# Altium schematic sheet sch_camera2.SchDoc
size A4
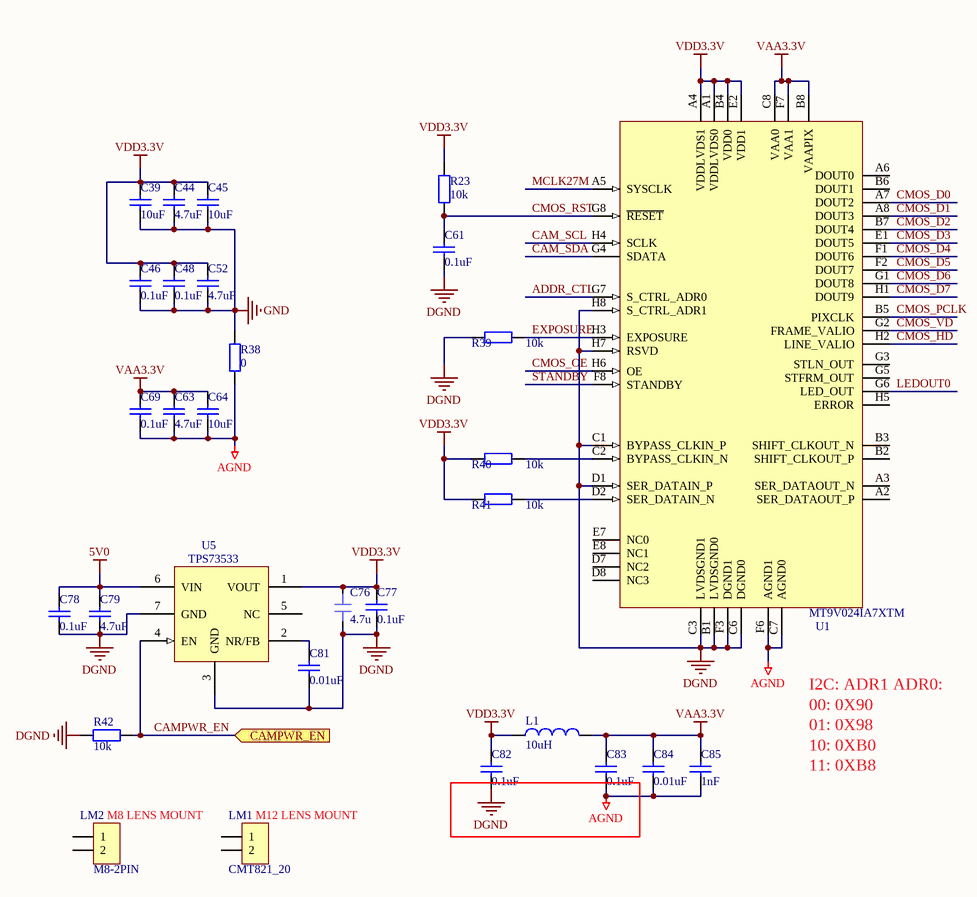
[diagram p0: sch_camera2.SchDoc]

## Parts
C39  10uF  [0805C]
C44  4.7uF  [0402C]
C45  10uF  [0805C]
C46  0.1uF  [0402C]
C48  0.1uF  [0402C]
C52  4.7uF  [0402C]
C61  0.1uF  [0402C]
C63  4.7uF  [0402C]
C64  10uF  [0805C]
C69  0.1uF  [0402C]
C76  4.7u  [0402C_L]
C77  0.1uF  [0402C_L]
C78  0.1uF  [0402C]
C79  4.7uF  [0402C_L]
C81  0.01uF  [0402C_L]
C82  0.1uF  [0402C_L]
C83  0.1uF  [0402C_L]
C84  0.01uF  [0402C_L]
C85  1nF  [0402C_L]
L1  10uH  [0805R]
LM1  CMT821_20  [PAD_M3_D350_450]
LM2  M8-2PIN  [PAD_M3_D350_450]
R23  10K  [0402R]
R38  value 0  [0402R]  (hidden comment: 0R)
R39  10K  [0402R]
R40  10K  [0402R]
R41  10K  [0402R]
R42  10K  [0402R_L]
U1  MT9V024IA7XTM  [IBGA52_8X8_P100L90W90H90R]
U5  TPS73533  [SON6_P65L21W21H8_DRV]

## Ports
CAMPWR_EN (in)

## Nets
5V0: C78.2 C79.2 U5.6(VIN)
AGND: C63.1 C64.1 C69.1 C83.1 C84.1 C85.1 R38.2 U1.C7(AGND0) U1.F6(AGND1)
DGND: C61.1 C76.2 C77.1 C78.1 C79.1 C81.1 C82.1 R39.2 R42.1 U1.B1(LVDSGND0) U1.C1(BYPASS_CLKIN_P) U1.C3(LVDSGND1) U1.C6(DGND0) U1.D1(SER_DATAIN_P) U1.F3(DGND1) U1.H7(RSVD) U1.H8(S_CTRL_ADR1) U5.3(GND) U5.7(GND)
GND: C39.1 C44.1 C45.1 C46.1 C48.1 C52.1 R38.1
VAA3.3V: C63.2 C64.2 C69.2 C83.2 C84.2 C85.2 L1.2 U1.B8(VAAPIX) U1.C8(VAA0) U1.F7(VAA1)
VDD3.3V: C39.2 C44.2 C45.2 C46.2 C48.2 C52.2 C76.1 C77.2 C82.2 L1.1 R23.2 R40.2 R41.2 U1.A1(VDDLVDS0) U1.A4(VDDLVDS1) U1.B4(VDD0) U1.E2(VDD1) U5.1(VOUT)
ADDR_CTL: U1.G7(S_CTRL_ADR0)
CAM_SCL: U1.H4(SCLK)
CAM_SDA: U1.G4(SDATA)
CAMPWR_EN: R42.2 U5.4(EN) ; port CAMPWR_EN
CMOS_D0: U1.A7(DOUT2)
CMOS_D1: U1.A8(DOUT3)
CMOS_D2: U1.B7(DOUT4)
CMOS_D3: U1.E1(DOUT5)
CMOS_D4: U1.F1(DOUT6)
CMOS_D5: U1.F2(DOUT7)
CMOS_D6: U1.G1(DOUT8)
CMOS_D7: U1.H1(DOUT9)
CMOS_HD: U1.H2(LINE_VALIO)
CMOS_OE: U1.H6(OE)
CMOS_PCLK: U1.B5(PIXCLK)
CMOS_RST: C61.2 R23.1 U1.G8(~{RESET})
CMOS_VD: U1.G2(FRAME_VALIO)
EXPOSURE: R39.1 U1.H3(EXPOSURE)
LEDOUT0: U1.G6(LED_OUT)
MCLK27M: U1.A5(SYSCLK)
STANDBY: U1.F8(STANDBY)
NetC81_2: C81.2 U5.2(NR/FB)
NetR40_1: R40.1 U1.C2(BYPASS_CLKIN_N)
NetR41_1: R41.1 U1.D2(SER_DATAIN_N)

Not connected (* = marked no-connect by the designer): LM1 1 2; LM2 1 2; U1 A2(SER_DATAOUT_P) A3(SER_DATAOUT_N) A6(DOUT0) B2(SHIFT_CLKOUT_P) B3(SHIFT_CLKOUT_N) B6(DOUT1) D7(NC2) D8(NC3) E7(NC0) E8(NC1) G3(STLN_OUT) G5(STFRM_OUT) H5(ERROR); U5 5(NC)

## Notes on the sheet
- I2C: ADR1 ADR0:
- 00: 0X90
- 01: 0X98
- 10: 0XB0
- 11: 0XB8
- (near LM2) M8 LENS MOUNT
- (near LM1) M12 LENS MOUNT

## Library data of the parts
C39 C44-C46 C48 C52 C61 C63 C64 C69 C77-C79 C81-C85 = Cap: Capacitor; Published: 8-Jun-2000; LatestRevisionDate: 17-Jul-2002; LatestRevisionNote: Re-released for DXP Platform.; Publisher: Altium Limited
  C39 C45 C64: PackageReference: RAD-0.3; Value: 10uF
  C44 C52 C63 C79: PackageReference: RAD-0.3; Value: 4.7uF
  C46 C48 C61 C69 C77 C78 C82 C83: Value: 0.1uF
  C81: PackageReference: RAD-0.3; Value: 0.01uF
  C84: Value: 0.01uF
  C85: Value: 1nF
C76 = cap0402: CC0402MRX5R5BB475; 元件类别: 贴片电容; 主物料厂家: YAGEO
L1 = Inductor: Value: 330mH
LM1 LM2 = CON2: Connector
R23 R38-R42 = Resistor: Published: 8-Jun-2000; LatestRevisionDate: 17-Jul-2002; LatestRevisionNote: Re-released for DXP Platform.; PackageReference: AXIAL-0.4; Publisher: Altium Limited
  R23 R39-R42: Value: 10k